# Altium project DC309A.PrjPcb (part 1 of 7)
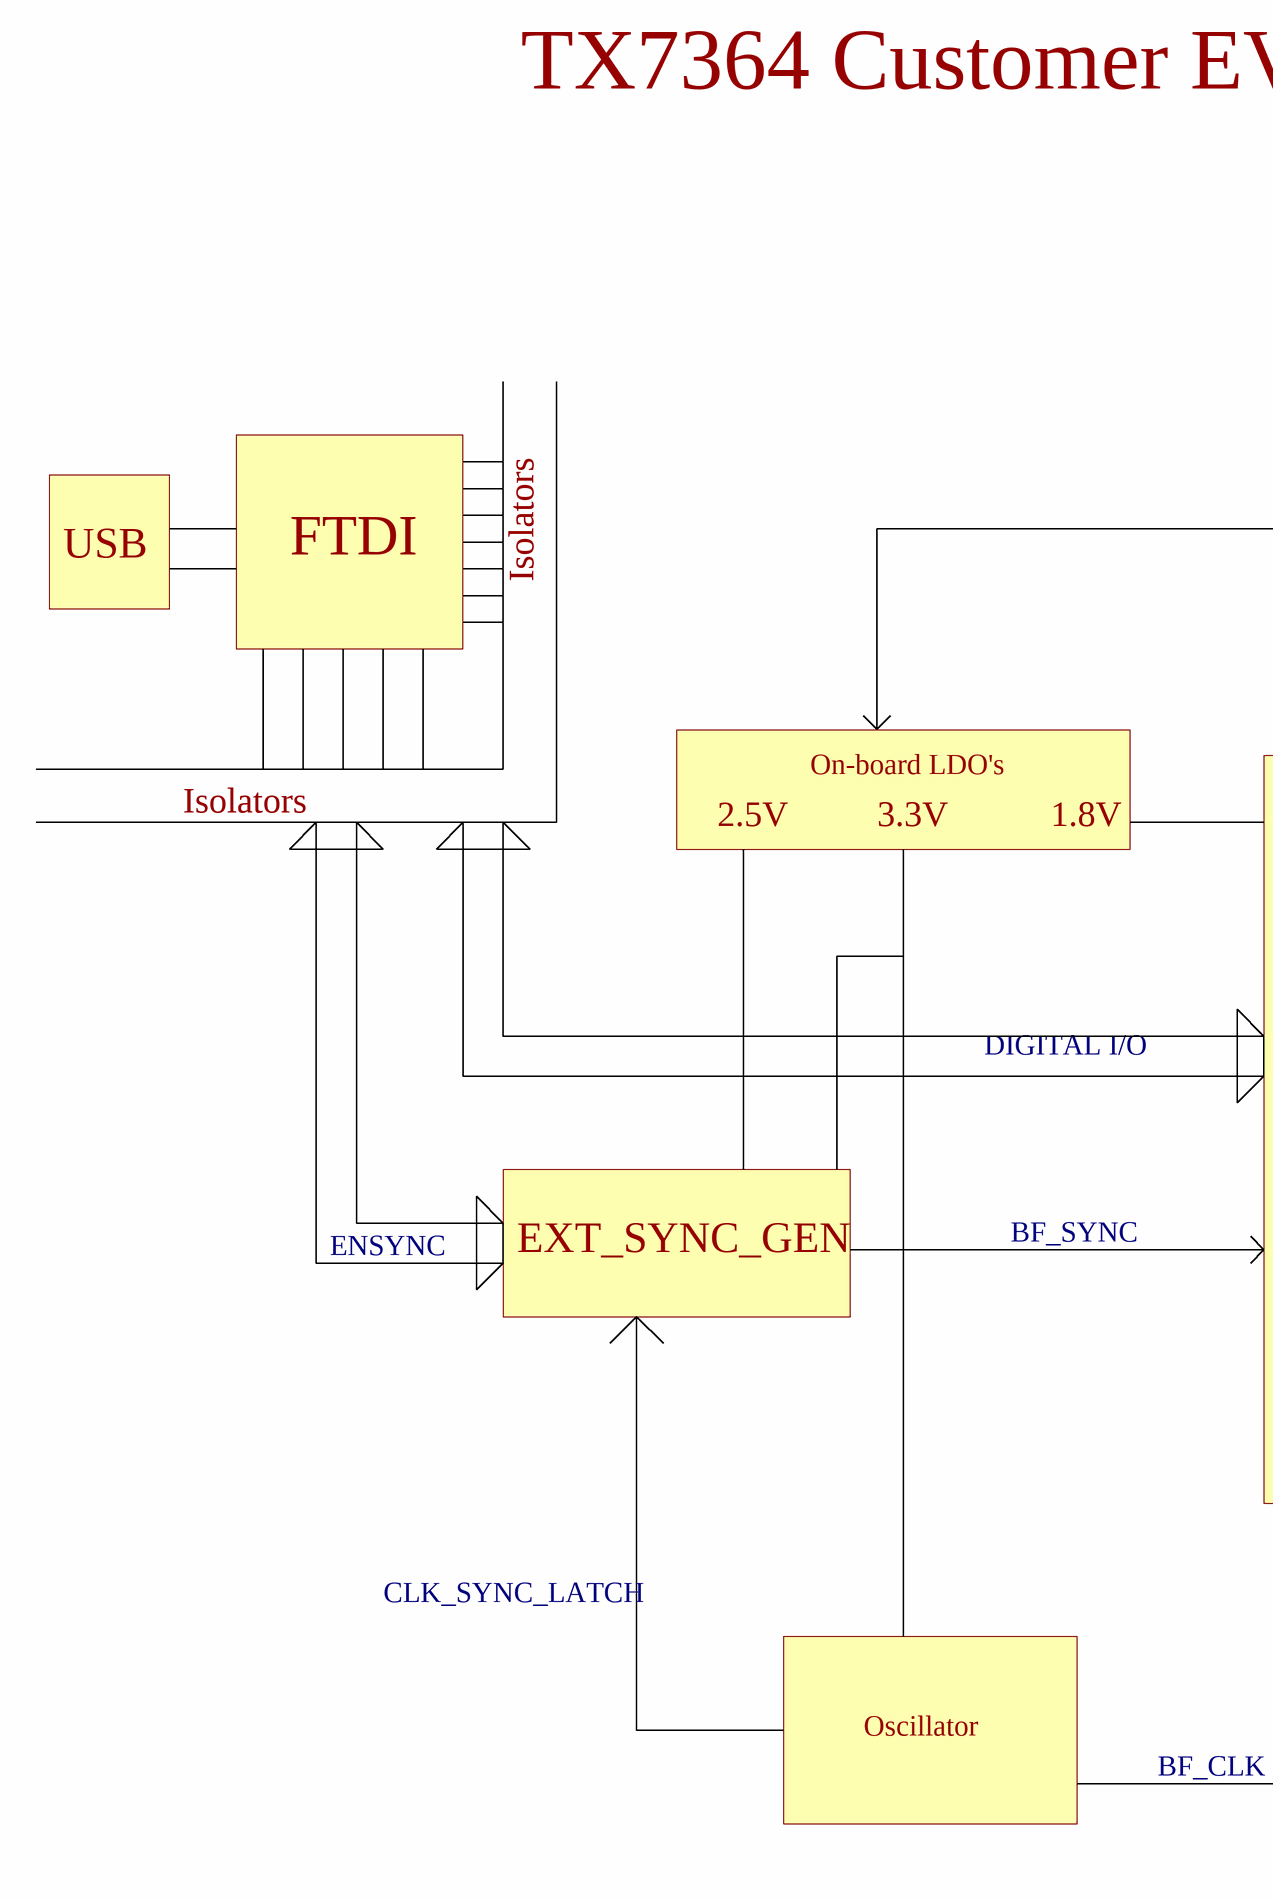
[diagram p0: DC309A_CoverPage_Compact.SchDoc, left]
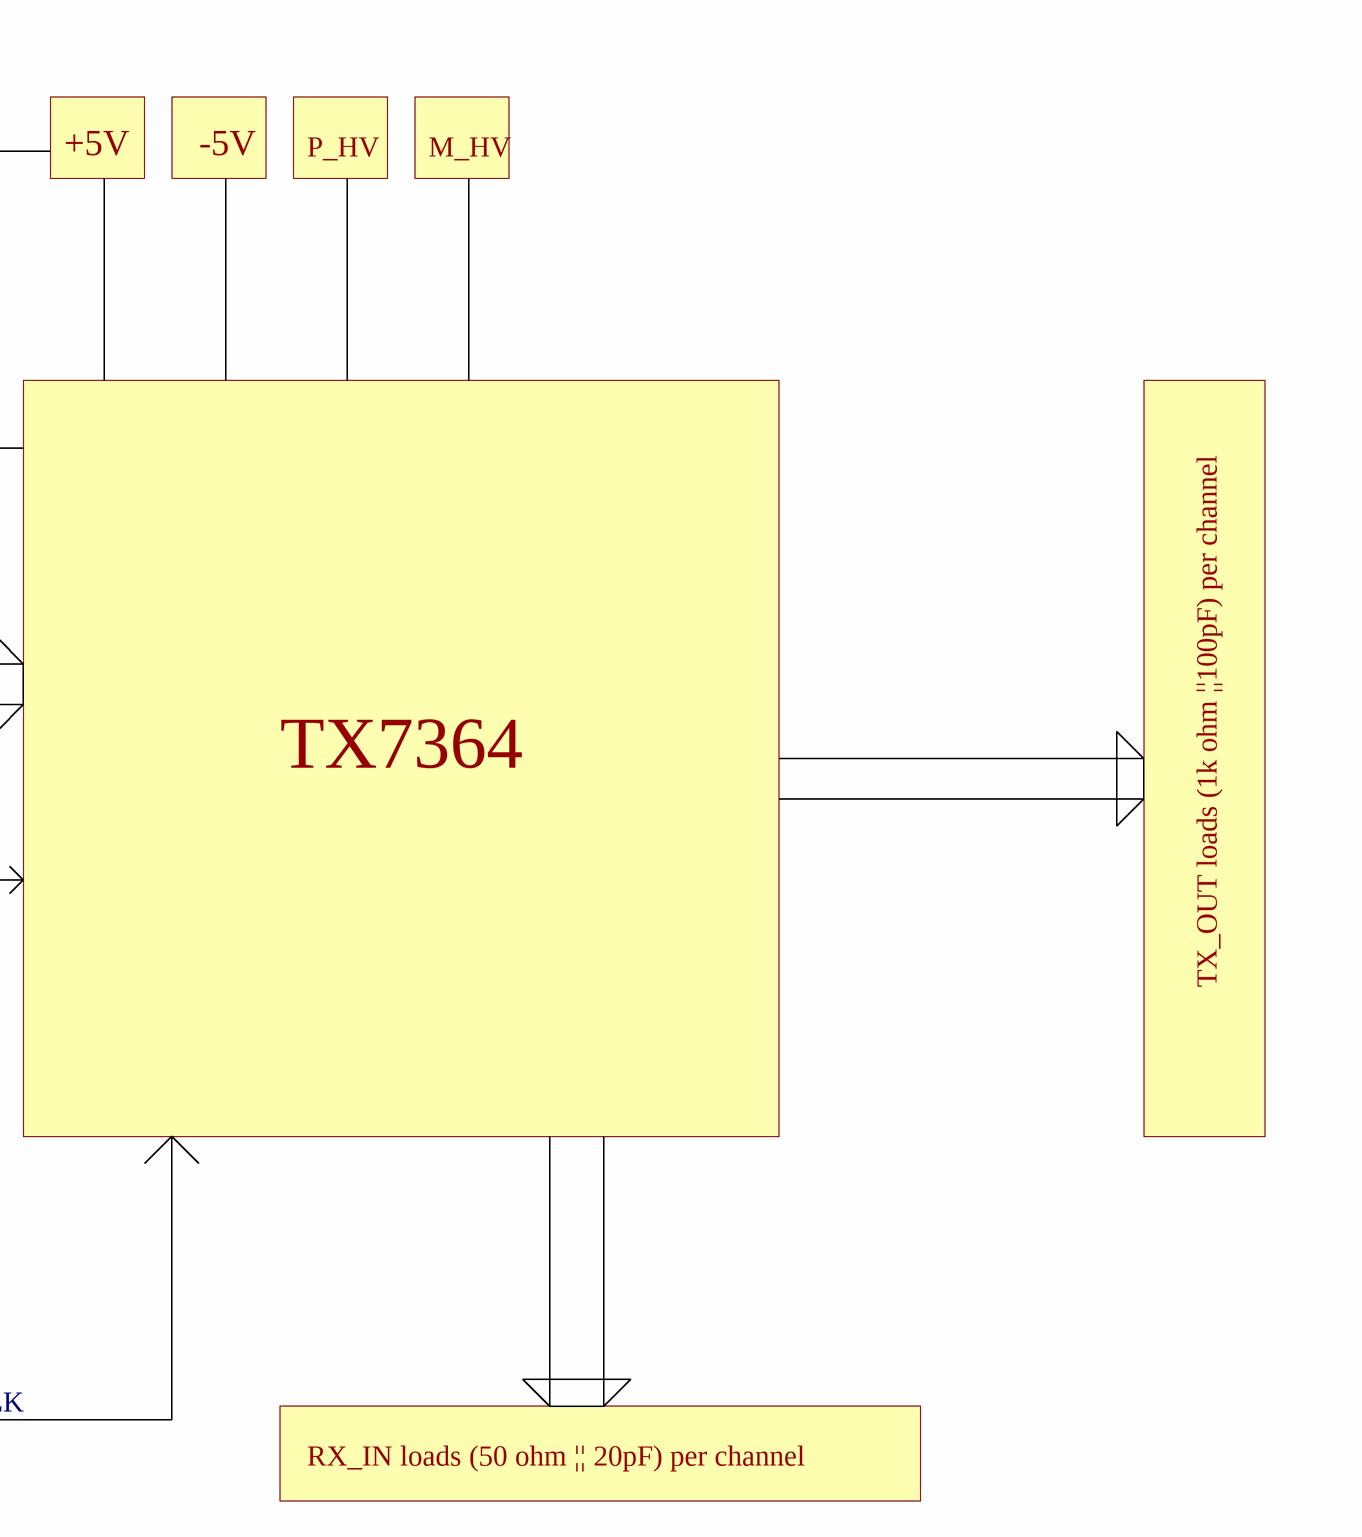
[diagram p1: DC309A_CoverPage_Compact.SchDoc, right]
CopyrightYear: 2018; DrawnBy: KAVIKANNAN; EVM_orderable: TX7364EVM; PCB_Layout: KAVIKANNAN; PCB_REV: A; PRJ_Customer: Public Release; PRJ_Engineer: ROSHAN; PRJ_Number: DC309; PRJ_Title: TX7364 EVM; SCH_Rev: A; TechSupport: http://www.ti.com/support; TID: N/A
11 sheets, 798 parts. Net scope: global (net labels, ports and power ports of the same name join across sheets).
Board file: DC309A.PcbDoc
Sheets:
  DC309A_CoverPage_Compact.SchDoc
  DC309A_Pinout.SchDoc
  DC309A_RXIN.SchDoc
  DC309A_TXOUT.SchDoc
  DC309A_PowerSupplies.SchDoc
  DC309A_FTDI.SchDoc
  DC309A_CLKGen.SchDoc
  DC309A_External_Sync.SchDoc
  DC309A_CPLD.SchDoc
  DC309A_FTDI(DNI).SchDoc
  DC309A_EVM_Hardware.SchDoc

## Sheet DC309A_CoverPage_Compact.SchDoc: CoverPage
size 558 x 431 mm; DrawnBy: KAVIKANNAN; DocumentNumber: 1; SheetNumber: 1; SheetTotal: 11; PageSetup: Record=PageOptions|CenterHorizontal=True|CenterVertical=True|PrintScale=1.00|XCorrection=1.00|YCorrection=1.00|PrintKind=0|BorderSize=5000000|LeftOffset=0|BottomOffset=0|Orientation=2|PaperLength=1000|PaperWidth=1000|Scale=100|PaperSource=15|PrintQuality=600|MediaType=1|DitherType=10|PaperKind=Letter|PrintScaleMode=1

### Notes on the sheet
- TX7364 Customer EVM : Functional block diagram
- USB
- FTDI
- Isolators
- +5V
- -5V
- P_HV
- M_HV
- On-board LDO's
- 2.5V
- 3.3V
- 1.8V
- DIGITAL I/O
- TX7364
- ENSYNC
- EXT_SYNC_GEN
- BF_SYNC
- TX_OUT loads (1k ohm ||100pF) per channel
- CLK_SYNC_LATCH
- Oscillator
- BF_CLK
- RX_IN loads (50 ohm || 20pF) per channel
- Drawn By:
- SVN Rev:
- Number:
- TID #:
- Orderable:
- Rev:
- Sheet Title:
- File:
- Project Title:
- Designed for:
- Assembly Variant:
- Mod. Date:
- Sheet:
- Size:
- of
- C
- http://www.ti.com
- Texas Instruments and/or its licensors do not warrant the accuracy or completeness of this specification or any information contained therein. Texas Instruments and/or its licensors do not warrant that this design will meet the specifications, will be suitable for your application or fit for any particular purpose, or will operate in an implementation. Texas Instruments and/or its licensors do not warrant that the design is production worthy. You should completely validate and test your design implementation to confirm the system functionality for your application.
- Engineer:
- Contact:
- © Texas Instruments

## Sheet DC309A_Pinout.SchDoc: Pinout
size 558 x 431 mm; DrawnBy: KAVIKANNAN; DocumentNumber: 2; SheetNumber: 2; SheetTotal: 11; PageSetup: Record=PageOptions|CenterHorizontal=True|CenterVertical=True|PrintScale=0.69|XCorrection=1.00|YCorrection=1.00|PrintKind=0|BorderSize=5000000|LeftOffset=0|BottomOffset=0|Orientation=2|PaperLength=1000|PaperWidth=1000|Scale=100|PaperSource=15|PrintQuality=600|MediaType=1|DitherType=10|PaperKind=Letter|PrintScaleMode=1
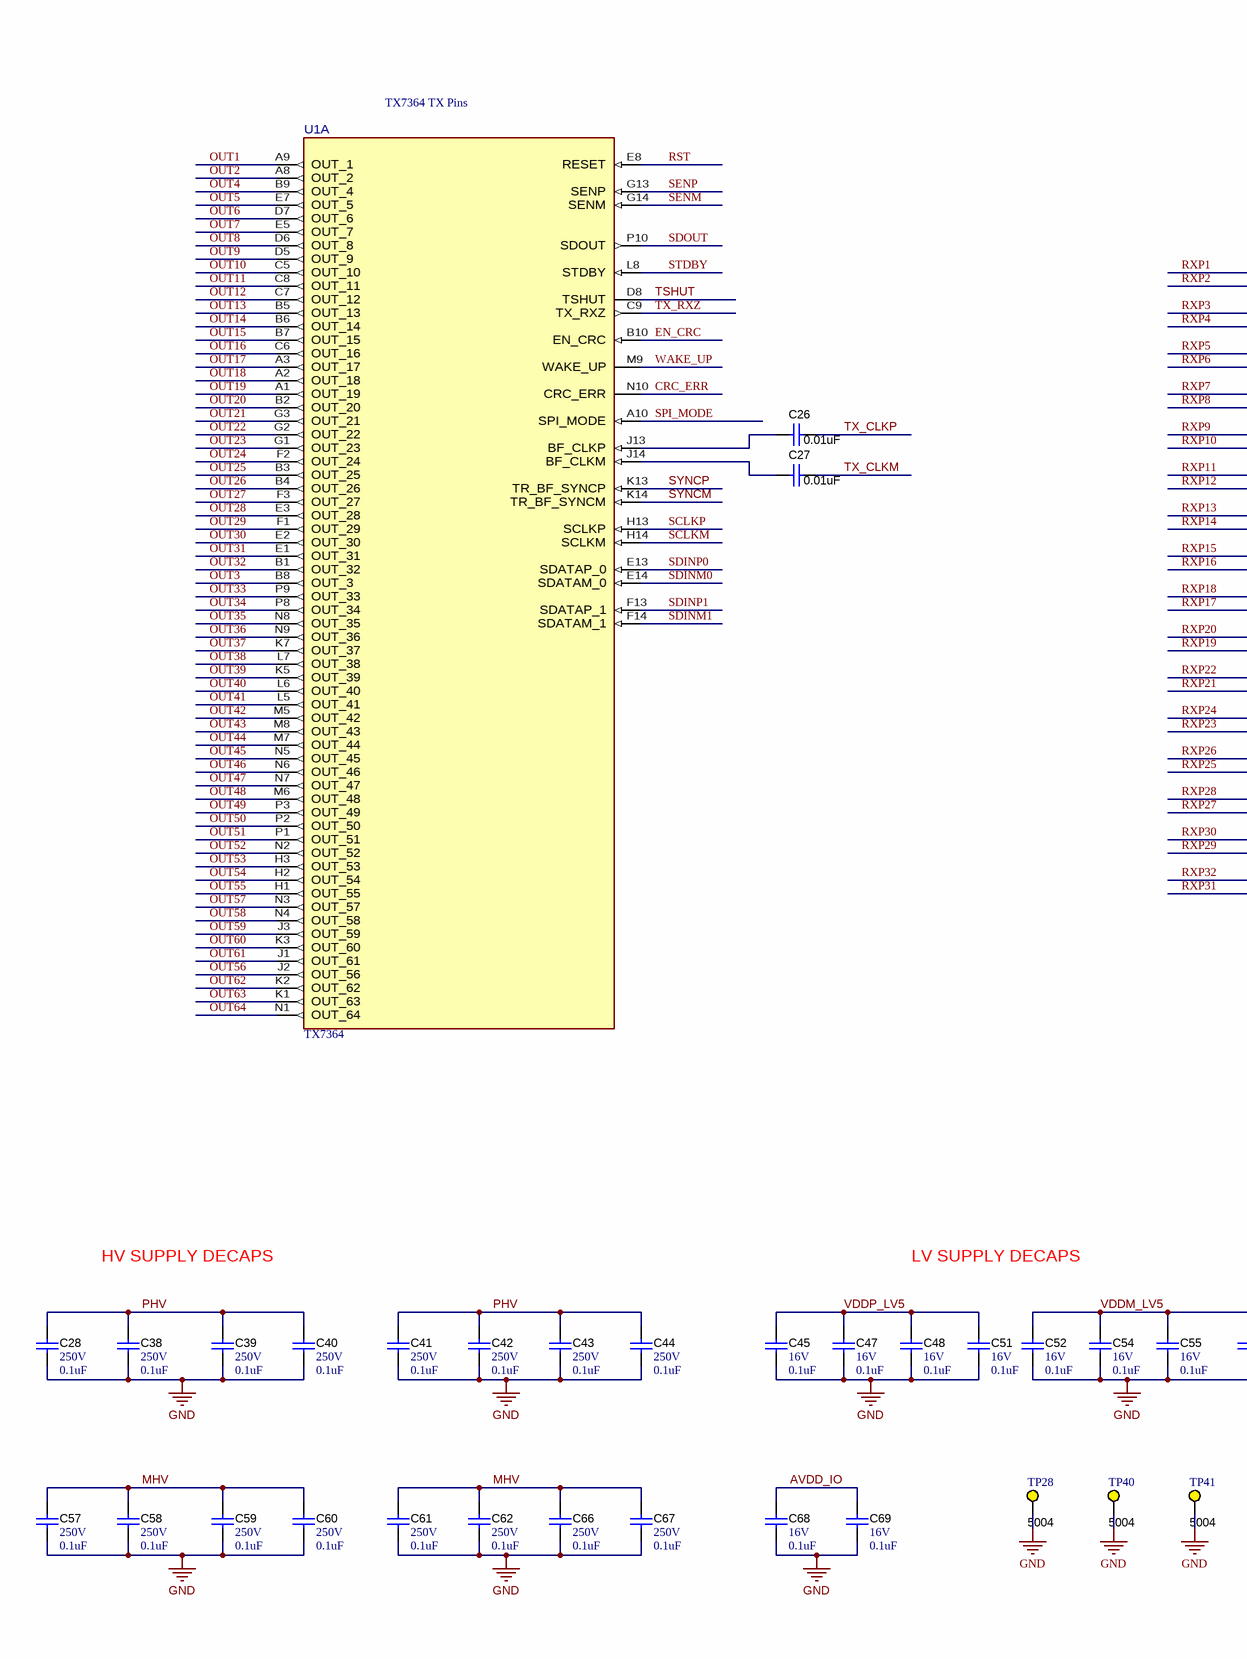
[diagram p2: DC309A_Pinout.SchDoc, left]
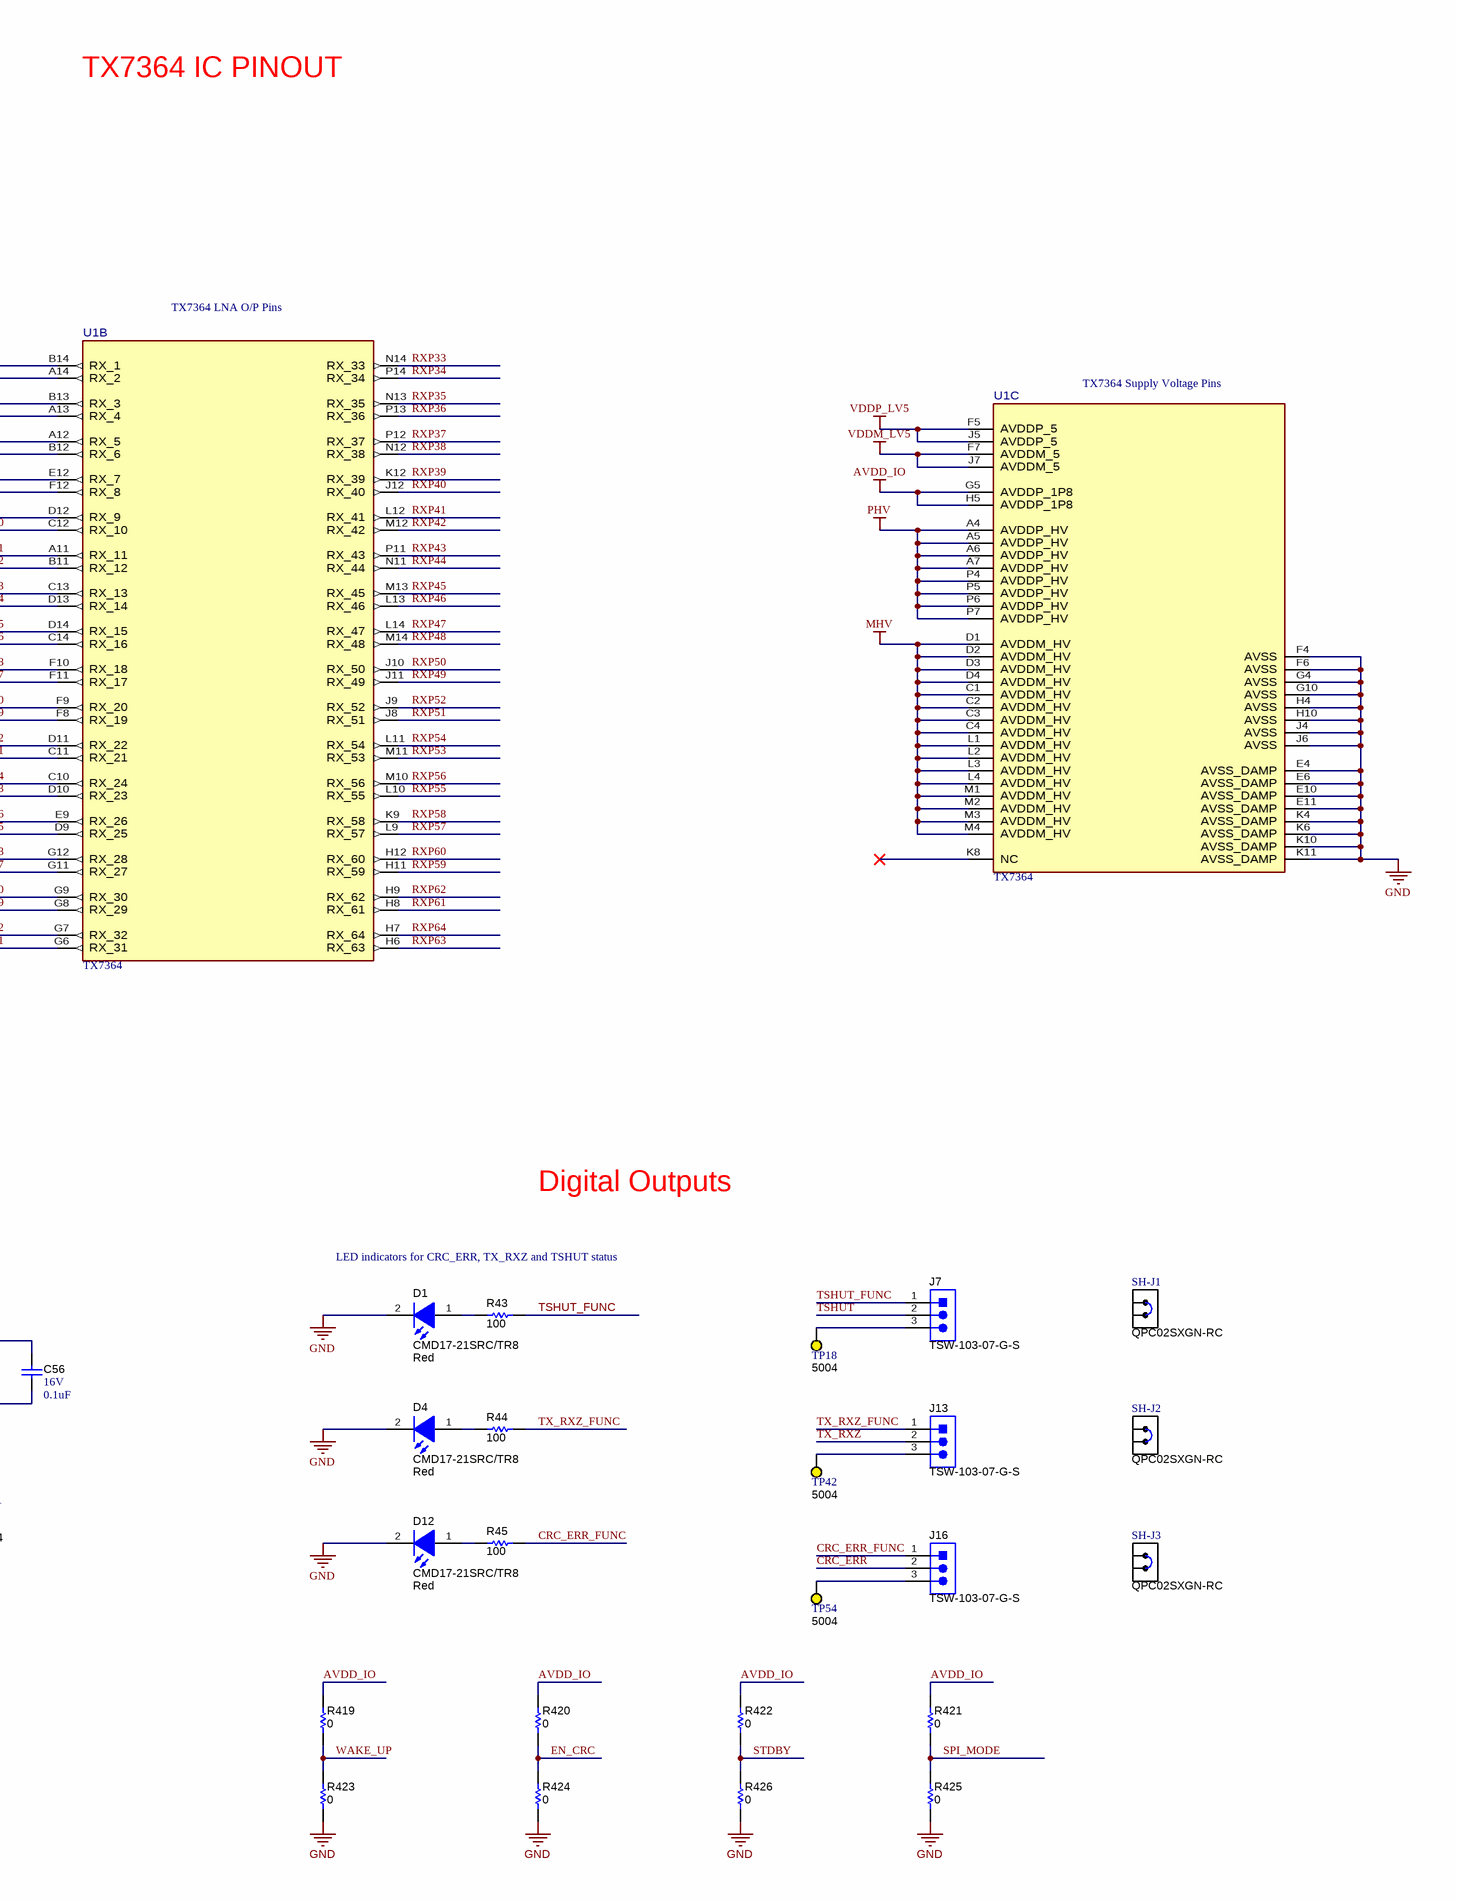
[diagram p3: DC309A_Pinout.SchDoc, right]

### Parts
C26  ValueDisplayed: 0.01uF  [0402_065]  (hidden comment: 520L103KT16T)
C27  ValueDisplayed: 0.01uF  [0402_065]  (hidden comment: 520L103KT16T)
C28  VDC_V: 250V  ValueDisplayed: 0.1uF  [0805_HV]  (hidden comment: C2012X7T2E104K125AA)
C38  VDC_V: 250V  ValueDisplayed: 0.1uF  [0805_HV]  (hidden comment: C2012X7T2E104K125AA)
C39  VDC_V: 250V  ValueDisplayed: 0.1uF  [0805_HV]  (hidden comment: C2012X7T2E104K125AA)
C40  VDC_V: 250V  ValueDisplayed: 0.1uF  [0805_HV]  (hidden comment: C2012X7T2E104K125AA)
C41  VDC_V: 250V  ValueDisplayed: 0.1uF  [0805_HV]  (hidden comment: C2012X7T2E104K125AA)
C42  VDC_V: 250V  ValueDisplayed: 0.1uF  [0805_HV]  (hidden comment: C2012X7T2E104K125AA)
C43  VDC_V: 250V  ValueDisplayed: 0.1uF  [0805_HV]  (hidden comment: C2012X7T2E104K125AA)
C44  VDC_V: 250V  ValueDisplayed: 0.1uF  [0805_HV]  (hidden comment: C2012X7T2E104K125AA)
C45  VDC_V: 16V  ValueDisplayed: 0.1uF  [0201_033]  (hidden comment: C0603X6S1C104K030BC)
C47  VDC_V: 16V  ValueDisplayed: 0.1uF  [0201_033]  (hidden comment: C0603X6S1C104K030BC)
C48  VDC_V: 16V  ValueDisplayed: 0.1uF  [0201_033]  (hidden comment: C0603X6S1C104K030BC)
C51  VDC_V: 16V  ValueDisplayed: 0.1uF  [0201_033]  (hidden comment: C0603X6S1C104K030BC)
C52  VDC_V: 16V  ValueDisplayed: 0.1uF  [0201_033]  (hidden comment: C0603X6S1C104K030BC)
C54  VDC_V: 16V  ValueDisplayed: 0.1uF  [0201_033]  (hidden comment: C0603X6S1C104K030BC)
C55  VDC_V: 16V  ValueDisplayed: 0.1uF  [0201_033]  (hidden comment: C0603X6S1C104K030BC)
C56  VDC_V: 16V  ValueDisplayed: 0.1uF  [0201_033]  (hidden comment: C0603X6S1C104K030BC)
C57  VDC_V: 250V  ValueDisplayed: 0.1uF  [0805_HV]  (hidden comment: C2012X7T2E104K125AA)
C58  VDC_V: 250V  ValueDisplayed: 0.1uF  [0805_HV]  (hidden comment: C2012X7T2E104K125AA)
C59  VDC_V: 250V  ValueDisplayed: 0.1uF  [0805_HV]  (hidden comment: C2012X7T2E104K125AA)
C60  VDC_V: 250V  ValueDisplayed: 0.1uF  [0805_HV]  (hidden comment: C2012X7T2E104K125AA)
C61  VDC_V: 250V  ValueDisplayed: 0.1uF  [0805_HV]  (hidden comment: C2012X7T2E104K125AA)
C62  VDC_V: 250V  ValueDisplayed: 0.1uF  [0805_HV]  (hidden comment: C2012X7T2E104K125AA)
C66  VDC_V: 250V  ValueDisplayed: 0.1uF  [0805_HV]  (hidden comment: C2012X7T2E104K125AA)
C67  VDC_V: 250V  ValueDisplayed: 0.1uF  [0805_HV]  (hidden comment: C2012X7T2E104K125AA)
C68  VDC_V: 16V  ValueDisplayed: 0.1uF  [0201_033]  (hidden comment: C0603X6S1C104K030BC)
C69  VDC_V: 16V  ValueDisplayed: 0.1uF  [0201_033]  (hidden comment: C0603X6S1C104K030BC)
D1  CMD17-21SRC/TR8  value Red  [CMD17-21_Red]
D4  CMD17-21SRC/TR8  value Red  [CMD17-21_Red]
D12  CMD17-21SRC/TR8  value Red  [CMD17-21_Red]
J7  TSW-103-07-G-S  [TSW-103-07-G-S]
J13  TSW-103-07-G-S  [TSW-103-07-G-S]
J16  TSW-103-07-G-S  [TSW-103-07-G-S]
R43  ValueDisplayed: 100  [0402]  (hidden comment: Resistor)
R44  ValueDisplayed: 100  [0402]  (hidden comment: Resistor)
R45  ValueDisplayed: 100  [0402]  (hidden comment: Resistor)
R419  Res_ohm: 0  [0402]  (hidden comment: Resistor)
R420  Res_ohm: 0  [0402]  (hidden comment: Resistor)
R421  Res_ohm: 0  [0402]  (hidden comment: Resistor)
R422  Res_ohm: 0  [0402]  (hidden comment: Resistor)
R423  Res_ohm: 0  [0402]  (hidden comment: Resistor)
R424  Res_ohm: 0  [0402]  (hidden comment: Resistor)
R425  Res_ohm: 0  [0402]  (hidden comment: Resistor)
R426  Res_ohm: 0  [0402]  (hidden comment: Resistor)
SH-J1  QPC02SXGN-RC  [FP-QPC02SXGN-RC_JUMPER-MFG]
SH-J2  QPC02SXGN-RC  [FP-QPC02SXGN-RC_JUMPER-MFG]
SH-J3  QPC02SXGN-RC  [FP-QPC02SXGN-RC_JUMPER-MFG]
TP18  5004  [Keystone5004]
TP28  5004  [Keystone5004]
TP40  5004  [Keystone5004]
TP41  5004  [Keystone5004]
TP42  5004  [Keystone5004]
TP54  5004  [Keystone5004]
U1  TX7364  [ACP0196A-MFG]  (parts A,B,C of 3)

### Nets
AVDD_IO: C68.1 C69.1 R419.2 R420.2 R421.2 R422.2 U1.G5(AVDDP_1P8) U1.H5(AVDDP_1P8)
GND: C28.2 C38.2 C39.2 C40.2 C41.2 C42.2 C43.2 C44.2 C45.2 C47.2 C48.2 C51.2 C52.2 C54.2 C55.2 C56.2 C57.2 C58.2 C59.2 C60.2 C61.2 C62.2 C66.2 C67.2 C68.2 C69.2 D1.2(K) D4.2(K) D12.2(K) R423.1 R424.1 R425.1 R426.1 TP28.1 TP40.1 TP41.1 U1.E4(AVSS_DAMP) U1.E6(AVSS_DAMP) U1.E10(AVSS_DAMP) U1.E11(AVSS_DAMP) U1.F4(AVSS) U1.F6(AVSS) U1.G4(AVSS) U1.G10(AVSS) U1.H4(AVSS) U1.H10(AVSS) U1.J4(AVSS) U1.J6(AVSS) U1.K4(AVSS_DAMP) U1.K6(AVSS_DAMP) U1.K10(AVSS_DAMP) U1.K11(AVSS_DAMP)
MHV: C57.1 C58.1 C59.1 C60.1 C61.1 C62.1 C66.1 C67.1 U1.C1(AVDDM_HV) U1.C2(AVDDM_HV) U1.C3(AVDDM_HV) U1.C4(AVDDM_HV) U1.D1(AVDDM_HV) U1.D2(AVDDM_HV) U1.D3(AVDDM_HV) U1.D4(AVDDM_HV) U1.L1(AVDDM_HV) U1.L2(AVDDM_HV) U1.L3(AVDDM_HV) U1.L4(AVDDM_HV) U1.M1(AVDDM_HV) U1.M2(AVDDM_HV) U1.M3(AVDDM_HV) U1.M4(AVDDM_HV)
PHV: C28.1 C38.1 C39.1 C40.1 C41.1 C42.1 C43.1 C44.1 U1.A4(AVDDP_HV) U1.A5(AVDDP_HV) U1.A6(AVDDP_HV) U1.A7(AVDDP_HV) U1.P4(AVDDP_HV) U1.P5(AVDDP_HV) U1.P6(AVDDP_HV) U1.P7(AVDDP_HV)
VDDM_LV5: C52.1 C54.1 C55.1 C56.1 U1.F7(AVDDM_5) U1.J7(AVDDM_5)
VDDP_LV5: C45.1 C47.1 C48.1 C51.1 U1.F5(AVDDP_5) U1.J5(AVDDP_5)
CRC_ERR: J16.2 U1.N10(CRC_ERR)
CRC_ERR_FUNC: J16.1 R45.1
EN_CRC: R420.1 R424.2 U1.B10(EN_CRC)
OUT1: U1.A9(OUT_1)
OUT2: U1.A8(OUT_2)
OUT3: U1.B8(OUT_3)
OUT4: U1.B9(OUT_4)
OUT5: U1.E7(OUT_5)
OUT6: U1.D7(OUT_6)
OUT7: U1.E5(OUT_7)
OUT8: U1.D6(OUT_8)
OUT9: U1.D5(OUT_9)
OUT10: U1.C5(OUT_10)
OUT11: U1.C8(OUT_11)
OUT12: U1.C7(OUT_12)
OUT13: U1.B5(OUT_13)
OUT14: U1.B6(OUT_14)
OUT15: U1.B7(OUT_15)
OUT16: U1.C6(OUT_16)
OUT17: U1.A3(OUT_17)
OUT18: U1.A2(OUT_18)
OUT19: U1.A1(OUT_19)
OUT20: U1.B2(OUT_20)
OUT21: U1.G3(OUT_21)
OUT22: U1.G2(OUT_22)
OUT23: U1.G1(OUT_23)
OUT24: U1.F2(OUT_24)
OUT25: U1.B3(OUT_25)
OUT26: U1.B4(OUT_26)
OUT27: U1.F3(OUT_27)
OUT28: U1.E3(OUT_28)
OUT29: U1.F1(OUT_29)
OUT30: U1.E2(OUT_30)
OUT31: U1.E1(OUT_31)
OUT32: U1.B1(OUT_32)
OUT33: U1.P9(OUT_33)
OUT34: U1.P8(OUT_34)
OUT35: U1.N8(OUT_35)
OUT36: U1.N9(OUT_36)
OUT37: U1.K7(OUT_37)
OUT38: U1.L7(OUT_38)
OUT39: U1.K5(OUT_39)
OUT40: U1.L6(OUT_40)
OUT41: U1.L5(OUT_41)
OUT42: U1.M5(OUT_42)
OUT43: U1.M8(OUT_43)
OUT44: U1.M7(OUT_44)
OUT45: U1.N5(OUT_45)
OUT46: U1.N6(OUT_46)
OUT47: U1.N7(OUT_47)
OUT48: U1.M6(OUT_48)
OUT49: U1.P3(OUT_49)
OUT50: U1.P2(OUT_50)
OUT51: U1.P1(OUT_51)
OUT52: U1.N2(OUT_52)
OUT53: U1.H3(OUT_53)
OUT54: U1.H2(OUT_54)
OUT55: U1.H1(OUT_55)
OUT56: U1.J2(OUT_56)
OUT57: U1.N3(OUT_57)
OUT58: U1.N4(OUT_58)
OUT59: U1.J3(OUT_59)
OUT60: U1.K3(OUT_60)
OUT61: U1.J1(OUT_61)
OUT62: U1.K2(OUT_62)
OUT63: U1.K1(OUT_63)
OUT64: U1.N1(OUT_64)
RST: U1.E8(RESET)
RXP1: U1.B14(RX_1)
RXP2: U1.A14(RX_2)
RXP3: U1.B13(RX_3)
RXP4: U1.A13(RX_4)
RXP5: U1.A12(RX_5)
RXP6: U1.B12(RX_6)
RXP7: U1.E12(RX_7)
RXP8: U1.F12(RX_8)
RXP9: U1.D12(RX_9)
RXP10: U1.C12(RX_10)
RXP11: U1.A11(RX_11)
RXP12: U1.B11(RX_12)
RXP13: U1.C13(RX_13)
RXP14: U1.D13(RX_14)
RXP15: U1.D14(RX_15)
RXP16: U1.C14(RX_16)
RXP17: U1.F11(RX_17)
RXP18: U1.F10(RX_18)
RXP19: U1.F8(RX_19)
RXP20: U1.F9(RX_20)
RXP21: U1.C11(RX_21)
RXP22: U1.D11(RX_22)
RXP23: U1.D10(RX_23)
RXP24: U1.C10(RX_24)
RXP25: U1.D9(RX_25)
RXP26: U1.E9(RX_26)
RXP27: U1.G11(RX_27)
RXP28: U1.G12(RX_28)
RXP29: U1.G8(RX_29)
RXP30: U1.G9(RX_30)
RXP31: U1.G6(RX_31)
RXP32: U1.G7(RX_32)
RXP33: U1.N14(RX_33)
RXP34: U1.P14(RX_34)
RXP35: U1.N13(RX_35)
RXP36: U1.P13(RX_36)
RXP37: U1.P12(RX_37)
RXP38: U1.N12(RX_38)
RXP39: U1.K12(RX_39)
RXP40: U1.J12(RX_40)
RXP41: U1.L12(RX_41)
RXP42: U1.M12(RX_42)
RXP43: U1.P11(RX_43)
RXP44: U1.N11(RX_44)
RXP45: U1.M13(RX_45)
RXP46: U1.L13(RX_46)
RXP47: U1.L14(RX_47)
RXP48: U1.M14(RX_48)
RXP49: U1.J11(RX_49)
RXP50: U1.J10(RX_50)
RXP51: U1.J8(RX_51)
RXP52: U1.J9(RX_52)
RXP53: U1.M11(RX_53)
RXP54: U1.L11(RX_54)
RXP55: U1.L10(RX_55)
RXP56: U1.M10(RX_56)
RXP57: U1.L9(RX_57)
RXP58: U1.K9(RX_58)
RXP59: U1.H11(RX_59)
RXP60: U1.H12(RX_60)
RXP61: U1.H8(RX_61)
RXP62: U1.H9(RX_62)
RXP63: U1.H6(RX_63)
RXP64: U1.H7(RX_64)
SCLKM: U1.H14(SCLKM)
SCLKP: U1.H13(SCLKP)
SDINM0: U1.E14(SDATAM_0)
SDINM1: U1.F14(SDATAM_1)
SDINP0: U1.E13(SDATAP_0)
SDINP1: U1.F13(SDATAP_1)
SDOUT: U1.P10(SDOUT)
SENM: U1.G14(SENM)
SENP: U1.G13(SENP)
SPI_MODE: R421.1 R425.2 U1.A10(SPI_MODE)
STDBY: R422.1 R426.2 U1.L8(STDBY)
SYNCM: U1.K14(TR_BF_SYNCM)
SYNCP: U1.K13(TR_BF_SYNCP)
TSHUT: J7.2 U1.D8(TSHUT)
TSHUT_FUNC: J7.1 R43.1
TX_CLKM: C27.2
TX_CLKP: C26.2
TX_RXZ: J13.2 U1.C9(TX_RXZ)
TX_RXZ_FUNC: J13.1 R44.1
WAKE_UP: R419.1 R423.2 U1.M9(WAKE_UP)
NetC26_1: C26.1 U1.J13(BF_CLKP)
NetC27_1: C27.1 U1.J14(BF_CLKM)
NetD1_1: D1.1(A) R43.2
NetD4_1: D4.1(A) R44.2
NetD12_1: D12.1(A) R45.2
NetJ7_3: J7.3 TP18.1
NetJ13_3: J13.3 TP42.1
NetJ16_3: J16.3 TP54.1

Not connected (* = marked no-connect by the designer): U1 K8(NC)*

### Notes on the sheet
- TX7364 IC PINOUT
- TX7364 TX Pins
- TX7364 LNA O/P Pins
- (near U1) TX7364 Supply Voltage Pins
- LED indicators for CRC_ERR, TX_RXZ and TSHUT status
- Digital Outputs
- HV SUPPLY DECAPS
- LV SUPPLY DECAPS
- Drawn By:
- SVN Rev:
- Number:
- TID #:
- Orderable:
- Rev:
- Sheet Title:
- File:
- Project Title:
- Designed for:
- Assembly Variant:
- Mod. Date:
- Sheet:
- Size:
- of
- C
- http://www.ti.com
- Texas Instruments and/or its licensors do not warrant the accuracy or completeness of this specification or any information contained therein. Texas Instruments and/or its licensors do not warrant that this design will meet the specifications, will be suitable for your application or fit for any particular purpose, or will operate in an implementation. Texas Instruments and/or its licensors do not warrant that the design is production worthy. You should completely validate and test your design implementation to confirm the system functionality for your application.
- Engineer:
- Contact:
- © Texas Instruments

### Library data of the parts
C26 C27 = CMP-0006210-2: CAP, CERM, 0.01 uF, 16 V, +/- 10%, X7R, 0402; Manufacturer: AT Ceramics; TaMin_C: -55°C; Polarized: N; SizeAreaWB_mm2: 3; Value1: Unknown; U/M: EA; Value: 0.01uF; TaMax_C: 125°C; SizeZ_mm: 0.65; SizeX_mm: 1; SizeY_mm: 0.5; Cap_Case: 0402; Value2: 16V; CompType: Capacitor; Cap_F: 10nF; AEC Category: Q200; Supplier Part Number 2: 581-520L103KT16T; Publisher: Texas Instruments; Supplier 2: Mouser; TempCo: X7R; Published: 2008-06-19; RoHS: Y; MountType: SMT; Supplier 1: Digi-Key; PackageReference: 0402; Tolerance_%: 10%; SizeArea_mm2: 0.5; LatestRevisionDate: 2017-03-09; PartNumber: 520L103KT16T; AEC Qualified: N; VDC_V: 16V; ComponentLink1Description: Datasheet link; AEC Grade: N/A; Supplier Part Number 1: 1284-1540-1-ND; Technology: Ceramic; ComponentLink1URL: https://www.atceramics.com/UserFiles/520l.pdf
C28 C38-C44 C57-C62 C66 C67 = CMP-0007897-1: CAP, CERM, 0.1 uF, 250 V, +/- 10%, X7T, 0805; Manufacturer: TDK; TaMin_C: -55°C; Polarized: N; SizeAreaWB_mm2: 6.75; Value1: Unknown; U/M: EA; Value: 0.1uF; TaMax_C: 125°C; SizeZ_mm: 1.45; SizeX_mm: 2; SizeY_mm: 1.25; Cap_Case: 0805; SizeArea_mm2: 2.5; Cap_F: 100nF; AEC Category: Q200; ComponentLink1URL: http://product.tdk.com/en/catalog/spec/mlccspec_commercial_general_midvoltage_en.pdf; Supplier Part Number 2: 51T2714; Publisher: Texas Instruments; Supplier 2: Newark; Supplier Part Number 3: 810-C2012X7T2E104KAA; TempCo: X7T; Supplier 3: Mouser; Published: 2008-06-19; RoHS: Y; MountType: SMT; Supplier 1: Digi-Key; PackageReference: 0805; Tolerance_%: 10%; Value2: 250V; CompType: Capacitor; LatestRevisionDate: 2017-03-09; PartNumber: C2012X7T2E104K125AA; AEC Qualified: N; ComponentLink1Description: Datasheet link; AEC Grade: N/A; Supplier Part Number 1: 445-7749-1-ND; Technology: Ceramic
C45 C47 C48 C51 C52 C54-C56 C68 C69 = CMP-0009637-3: CAP, CERM, 0.1 uF, 16 V, +/- 10%, X6S, 0201; Manufacturer: TDK; TaMin_C: -55°C; Polarized: N; SizeAreaWB_mm2: 2.08; Value1: Unknown; U/M: EA; Value: 0.1uF; TaMax_C: 105°C; SizeZ_mm: 0.33; SizeX_mm: 0.6; SizeY_mm: 0.3; Cap_Case: 0201; SizeArea_mm2: 0.18; Cap_F: 100nF; AEC Category: Q200; ComponentLink1URL: http://product.tdk.com/en/catalog/datasheets/mlcc_commercial_general_en.pdf; Supplier Part Number 2: 17X8592; Publisher: Texas Instruments; Supplier 2: Newark; Supplier Part Number 3: 810-C0603X6S1C104KBC; TempCo: X6S; Supplier 3: Mouser; Published: 2008-06-19; RoHS: Y; MountType: SMT; Supplier 1: Digi-Key; PackageReference: 0201; Tolerance_%: 10%; Value2: 16V; CompType: Capacitor; LatestRevisionDate: 2017-03-09; PartNumber: C0603X6S1C104K030BC; AEC Qualified: N; ComponentLink1Description: Datasheet link; AEC Grade: N/A; Supplier Part Number 1: 445-15903-1-ND; Technology: Ceramic
D1 D4 D12 = CMP-0084855-1: LED, Red, SMD; Manufacturer: Visual Communications Company, LLC; SizeX_mm: 2; SizeArea_mm2: 2.5; SizeAreaWB_mm2: 6.75; Angle: 140; Value2: 1.7V; Ir_A: 100µA; Value1: 0.1W; SizeY_mm: 1.25; Io_A: 20mA; Tjmax_C: 85°C; Power_TotalModule: 100mW; SizeZ_mm: 1.2; Vr_V: 5V; ComponentLink1URL: https://vcclite.com/wp-content/uploads/wpallimport/files/files/CMD1721Seriesver3.pdf; ComponentLink1Description: Datasheet link; PackageReference: 2x1.25mm; Color: Red; PartNumber: CMD17-21SRC/TR8; Vf_V: 1.7V; RoHS: Y; MountType: SMT; Type: ?; CompType: LED
J7 J13 J16 = CMP-0075407-2: Header, 100mil, 3x1, Gold, TH; Manufacturer: Samtec; Pitch_mm: 2.54; Cert_VDE: N; Gender: Male; Cert_CSA: Y; Voltage_V: 550V; Green_REACh: Passed; Current_A: 6.3A; Green_Lifecycle: Active; Row_Count: 1; ComponentLink1Description: Datasheet URL; RoHS: Y; Supplier 1: Digi-Key; Cert_UL: Y; Orientation: Vertical; Green_EU RoHS: Passed; PackageReference: 3x1 Header; Color: Black; PartNumber: TSW-103-07-G-S; PinCount: 3; ContactFinish: Gold; Cert_CULUS: N; Shrouded: N; ClassName: Header; ComponentLink1URL: http://samtec.com/ftppub/pdf/TSW_TH.PDF; CompType: Header; MountType: TH; Supplier Part Number 1: SAM1029-03-ND; Green_EU RoHS-2: Passed
R43-R45 = CMP-0026993-2: RES, 100, 5%, 0.1 W, AEC-Q200 Grade 0, 0402; PartNumber: ERJ-2GEJ101X; Manufacturer: Panasonic; Value: 100; Value_Code: 100R; Power_W: 100mW; Value2: 0.1W; TempCo: 200 ppm/C; SizeArea_mm2: 0.5; SizeX_mm: 1; SizeZ_mm: 0.6; EIA_Code: E24; U/M: EA; AEC Category: Q200; AEC Qualified: Y; AEC Grade: 0; CompType: Resistor; PackageReference: 0402; RoHS: Y; Res_ohm: 100; Tolerance_%: 5%; Value1: 5%; MountType: SMT; Technology: Thick Film; SizeY_mm: 0.5; Published: 2008-06-26; Publisher: Texas Instruments; LatestRevisionDate: 2017-03-09; ComponentLink1Description: Datasheet link; ComponentLink1URL: https://industrial.panasonic.com/cdbs/www-data/pdf/RDA0000/AOA0000C84.pdf; Supplier 1: Digi-Key; Supplier Part Number 1: P100JCT-ND; Supplier 2: Newark; Supplier Part Number 2: 65T8246; Supplier 3: Farnell; Supplier Part Number 3: 2059210
R419-R426 = CMP-0026992-3: RES, 0, 5%, 0.1 W, AEC-Q200 Grade 0, 0402; PartNumber: ERJ-2GE0R00X; Manufacturer: Panasonic; Value_Code: 0000; Power_W: 100mW; Value2: 0.1W; VDC_V: 50V; TempCo: 600 ppm/C; SizeArea_mm2: 0.5; SizeX_mm: 1; SizeZ_mm: 0.6; EIA_Code: E24; AEC Category: Q200; AEC Qualified: Y; SizeAreaWB_mm2: 3; CompType: Resistor; PackageReference: 0402; RoHS: Y; Tolerance_%: 5%; Value1: 5%; MountType: SMT; Technology: Thick Film; SizeY_mm: 0.5; ComponentLink1Description: Datasheet link; ComponentLink1URL: https://industrial.panasonic.com/cdbs/www-data/pdf/RDA0000/AOA0000C301.pdf; Supplier 1: Digi-Key; Supplier Part Number 1: P0.0JCT-ND; Supplier 2: Newark; Supplier Part Number 2: 65T8307; Supplier 3: Mouser; Supplier Part Number 3: 667-ERJ-2GE0R00X; AEC Grade: 0; ValueDisplayed: 0
SH-J1-SH-J3 = CMP-0087961-2: CONN JUMPER S2 (1 x 2) Position Shunt Connector Black Open Top 0.100" (2.54mm) GoldHORTING .100" GOLD; Manufacturer: Sullins; Current_A: 3A; Symbol Name: SYM-QPC02SXGN-RC; RoHS: TRUE; PackageReference: JUMPER; PartNumber: QPC02SXGN-RC; ContactFinish: Gold; ComponentLink1URL: https://s3.amazonaws.com/catalogspreads-pdf/PAGE128-129%20.100%20JUMPER.pdf; ComponentLink1Description: Datasheet; PinCount: 2
TP18 TP28 TP40-TP42 TP54 = CMP-0055141-2: Test Point, Miniature, Yellow, TH; Manufacturer: Keystone Electronics; CT: TRUE; ContactFinish: Silver; Green_Lifecycle: Active; CNHeader: FALSE; Green_REACh: Passed; Supplier 2: Mouser; RoHS: Y; Publisher: Texas Instruments; PackageReference: Yellow Miniature Testpoint; CompType: Test Point; Green_EU RoHS: Passed; Color: Yellow; PartNumber: 5004; Green_EU RoHS-2: Incomplete; LatestRevisionDate: 26/05/2017; Supplier 1: Digi-Key; Supplier Part Number 1: 36-5004-ND; Supplier Part Number 2: 534-5004; MountType: TH; ComponentLink1URL: http://www.keyelco.com/userAssets/file/M60-2p60.pdf; ComponentLink1Description: Datasheet URL
U1 = CMP-0096492-3: Manufacturer: Texas Instruments; CompType: IC; AEC Category: Q200; Standoff Height: 0.293mm; SizeZ_mm: 1.321mm; ComponentLink1Description: Datasheet Link; Part Number: TX7364; PartNumber: TX7364; ComponentLink2URL: http://www.ti.com/product/GPN; Operating Temperature Range: to; ComponentLink3URL: http://www.ti.com/product/GPN/datasheet; Datasheet Path: datasheets/IC-TX7364.pdf; ComponentLink3Description: Online Datasheet; ComponentLink1URL: http://www.ti.com/lit/ds/symlink/GPN.pdf; ComponentLink2Description: Product Folder; helpURL: https://upverter.com/upn/revision/116a209f64e0270f/; PackageReference: FCBGA196; RoHS: UNKNOWN; PartId: 1

## Sheet DC309A_RXIN.SchDoc: RXIN
size 558 x 431 mm; Date: Not shown in title block; ApprovedBy: Not shown in title block; CheckedBy: Not shown in title block; Author: Not shown in title block; CompanyName: Not shown in title block; DrawnBy: KAVIKANNAN; Engineer: Not shown in title block; Organization: Not shown in title block; Address1: Not shown in title block; Address2: Not shown in title block; Address3: Not shown in title block; Address4: Not shown in title block; DocumentNumber: 3; Revision: Use project parameter SCH_Rev; SheetNumber: 3; SheetTotal: 11; PageSetup: Record=PageOptions|CenterHorizontal=True|CenterVertical=True|PrintScale=1.00|XCorrection=1.00|YCorrection=1.00|PrintKind=0|BorderSize=5000000|LeftOffset=0|BottomOffset=0|Orientation=2|PaperLength=1000|PaperWidth=1000|Scale=100|PaperSource=15|PrintQuality=600|MediaType=1|DitherType=10|PaperKind=Letter|PrintScaleMode=1; CurrentTime: Not shown in title block; CurrentDate: Not shown in title block; Time: Not shown in title block; DocumentFullPathAndName: Not shown in title block; DocumentName: Not shown in title block; ModifiedDate: Not shown in title block; ImagePath: Not shown in title block
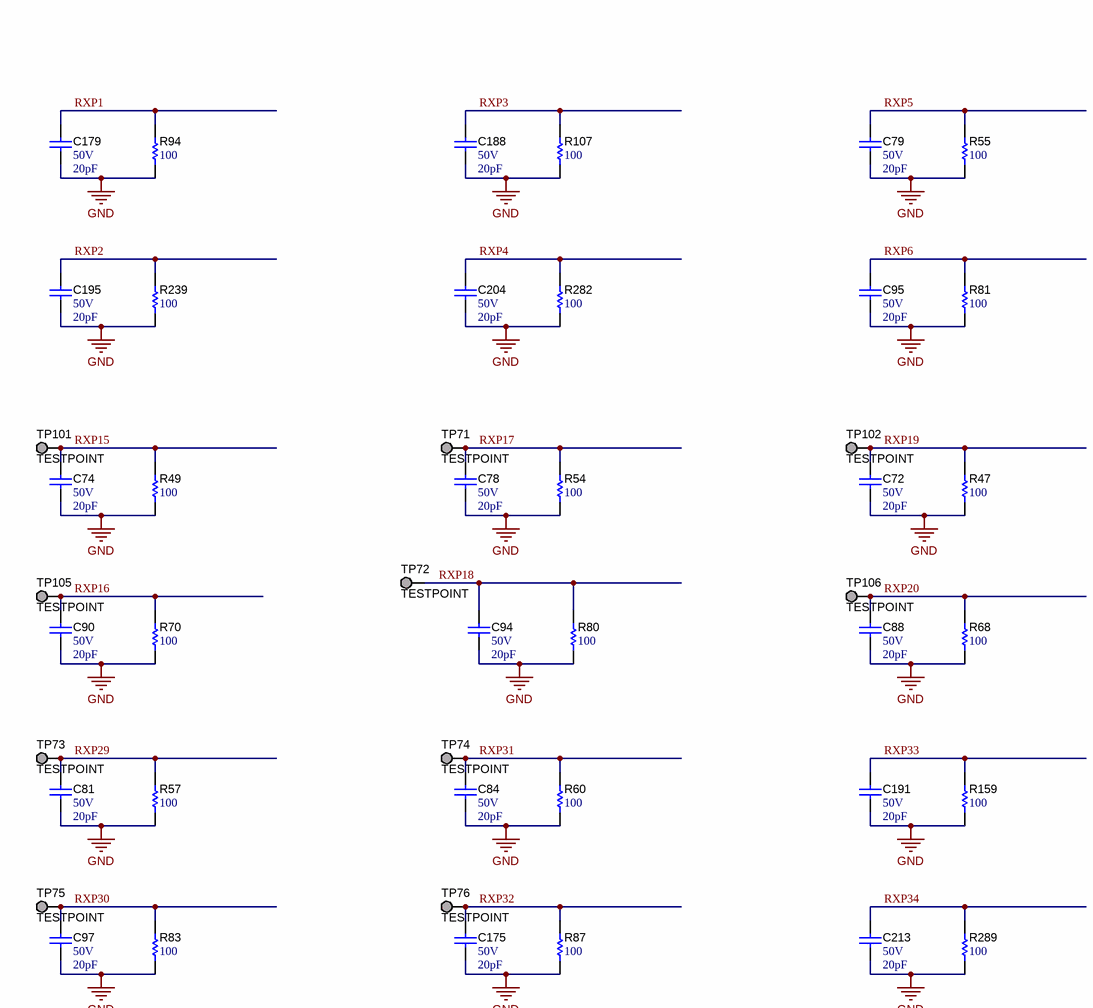
[diagram p4: DC309A_RXIN.SchDoc, top left]
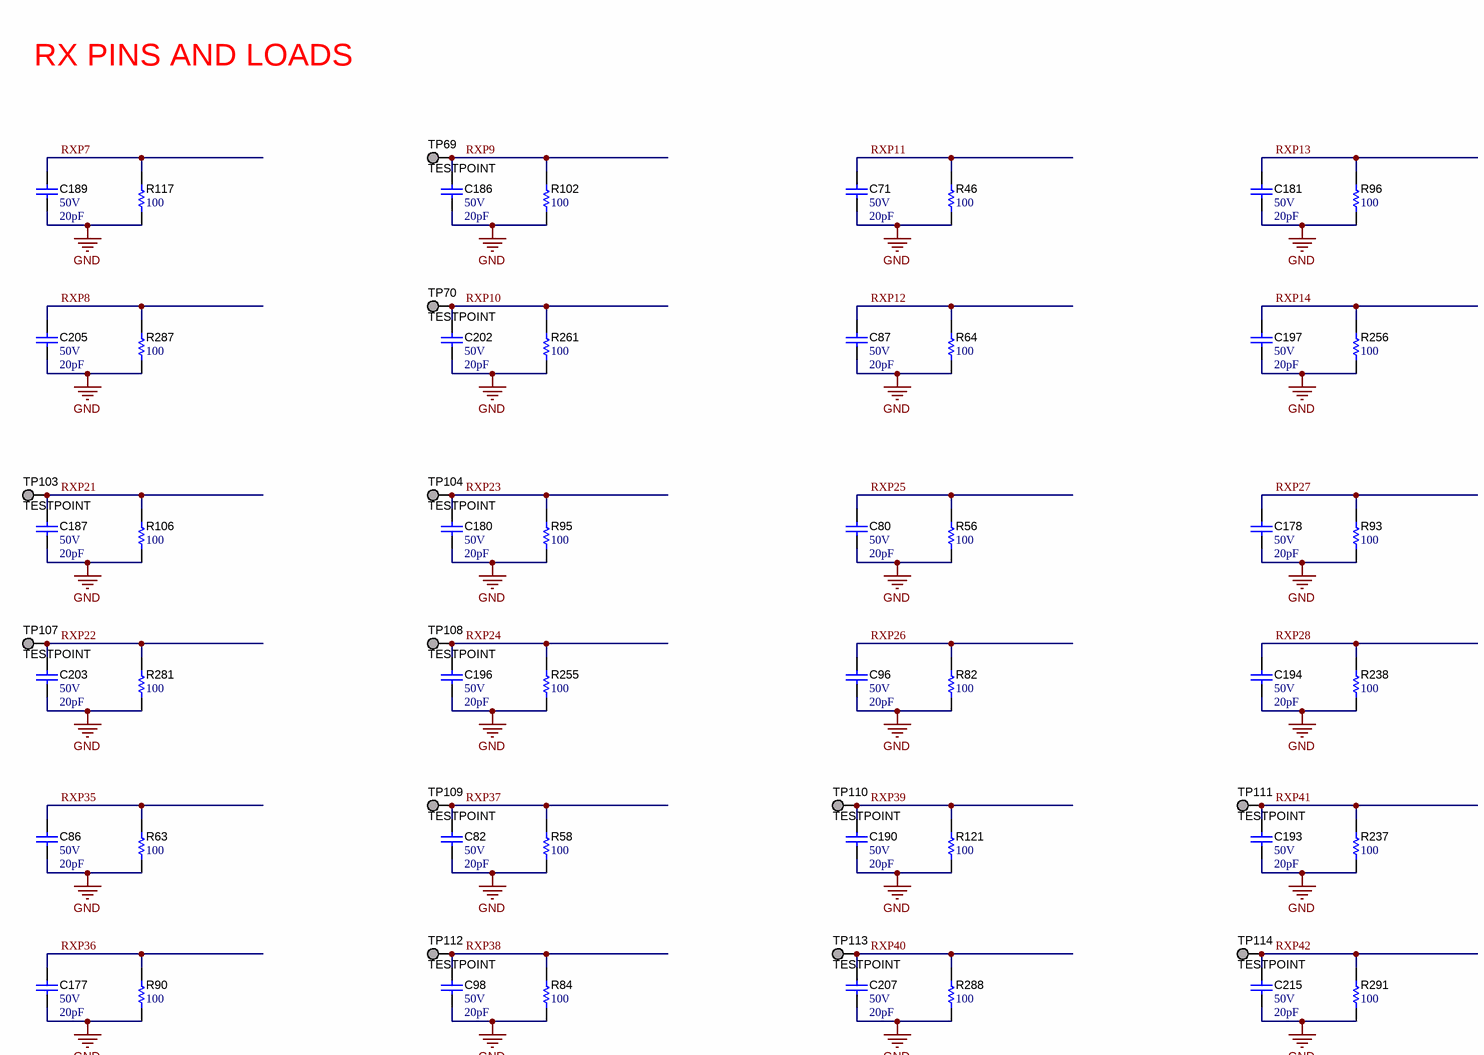
[diagram p5: DC309A_RXIN.SchDoc, top right]
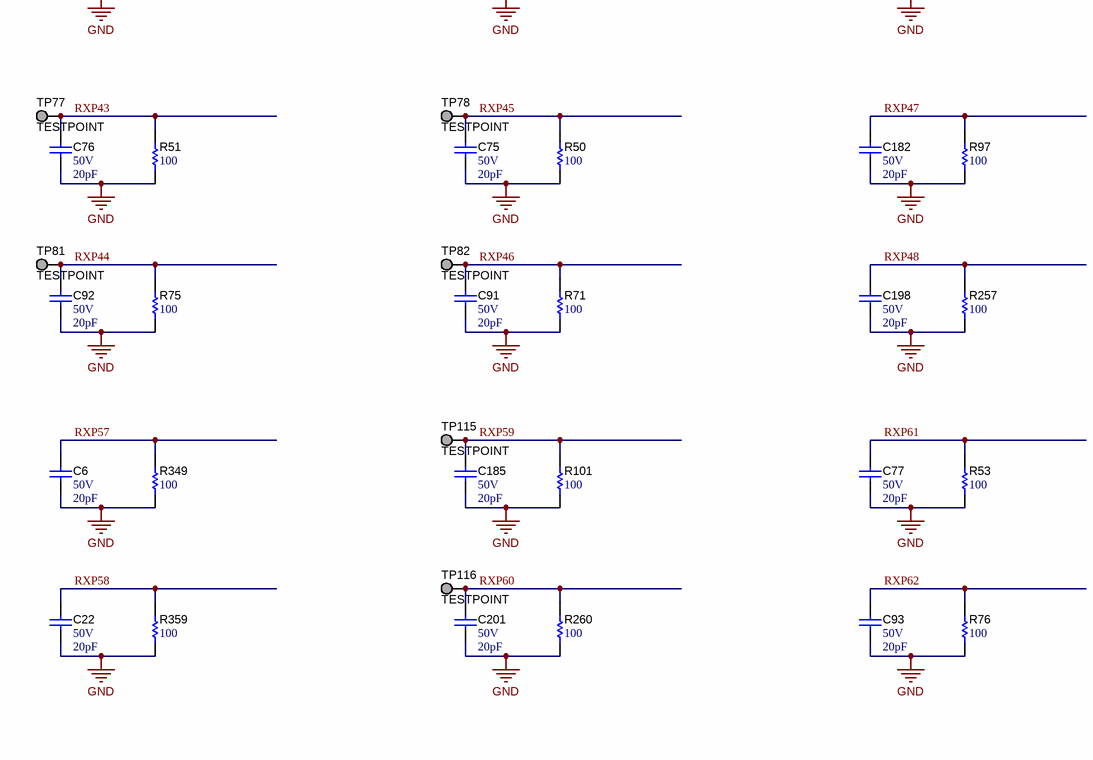
[diagram p6: DC309A_RXIN.SchDoc, bottom left]
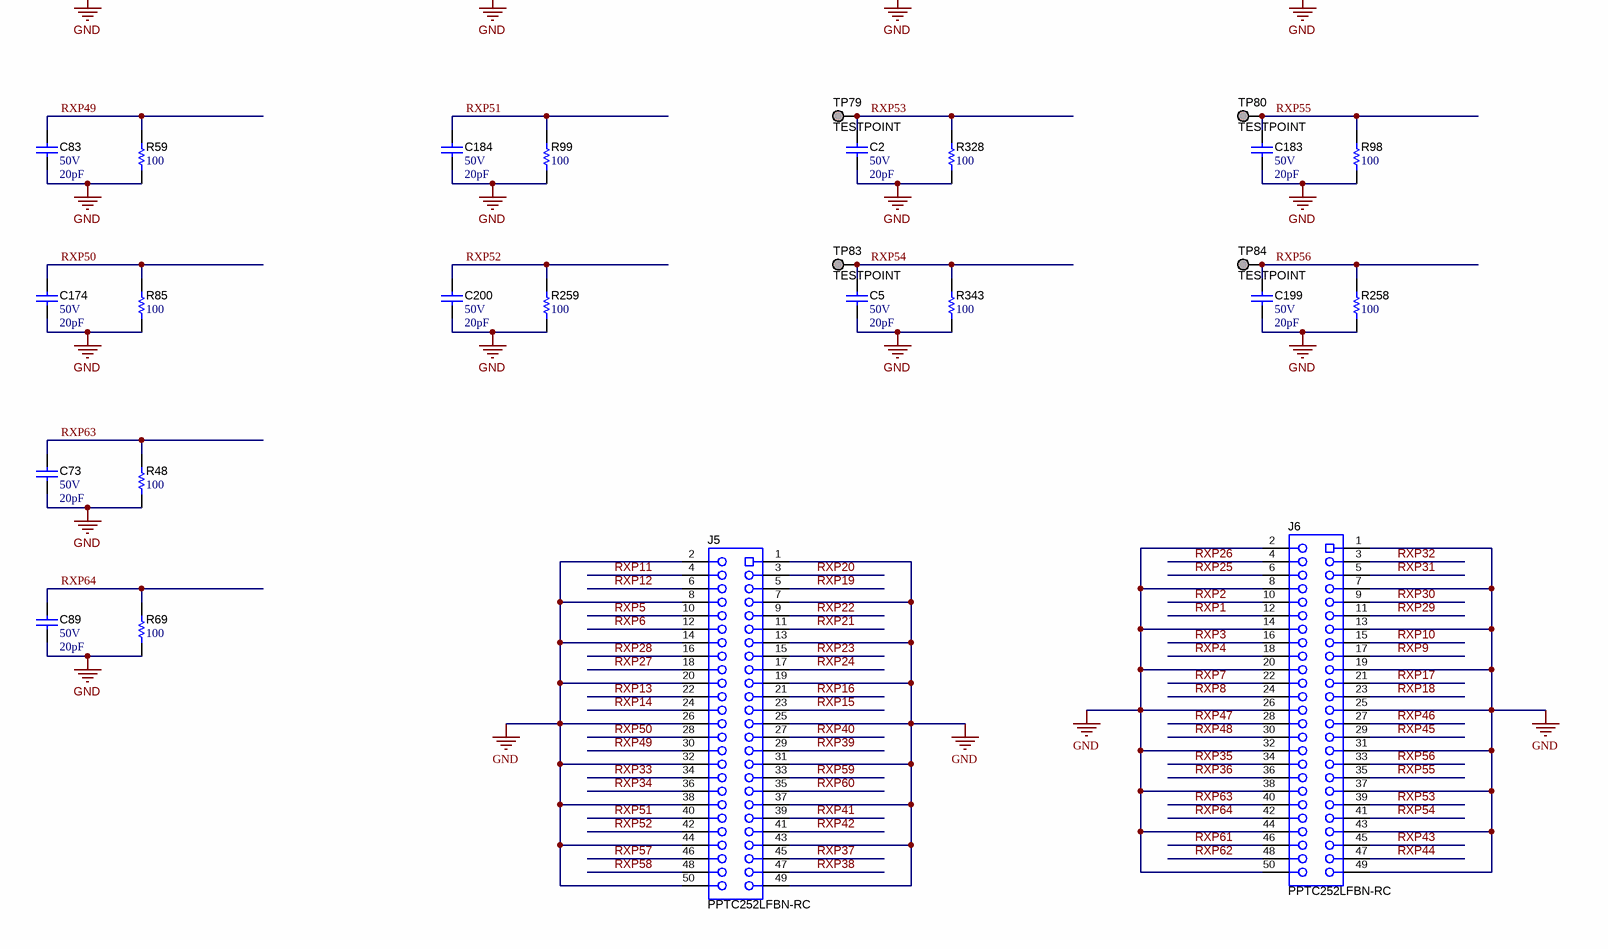
[diagram p7: DC309A_RXIN.SchDoc, bottom right]

### Parts
C2  VDC_V: 50V  ValueDisplayed: 20pF  [0402]  (hidden comment: C0402C200J5GACTU)
C5  VDC_V: 50V  ValueDisplayed: 20pF  [0402]  (hidden comment: C0402C200J5GACTU)
C6  VDC_V: 50V  ValueDisplayed: 20pF  [0402]  (hidden comment: C0402C200J5GACTU)
C22  VDC_V: 50V  ValueDisplayed: 20pF  [0402]  (hidden comment: C0402C200J5GACTU)
C71  VDC_V: 50V  ValueDisplayed: 20pF  [0402]  (hidden comment: C0402C200J5GACTU)
C72  VDC_V: 50V  ValueDisplayed: 20pF  [0402]  (hidden comment: C0402C200J5GACTU)
C73  VDC_V: 50V  ValueDisplayed: 20pF  [0402]  (hidden comment: C0402C200J5GACTU)
C74  VDC_V: 50V  ValueDisplayed: 20pF  [0402]  (hidden comment: C0402C200J5GACTU)
C75  VDC_V: 50V  ValueDisplayed: 20pF  [0402]  (hidden comment: C0402C200J5GACTU)
C76  VDC_V: 50V  ValueDisplayed: 20pF  [0402]  (hidden comment: C0402C200J5GACTU)
C77  VDC_V: 50V  ValueDisplayed: 20pF  [0402]  (hidden comment: C0402C200J5GACTU)
C78  VDC_V: 50V  ValueDisplayed: 20pF  [0402]  (hidden comment: C0402C200J5GACTU)
C79  VDC_V: 50V  ValueDisplayed: 20pF  [0402]  (hidden comment: C0402C200J5GACTU)
C80  VDC_V: 50V  ValueDisplayed: 20pF  [0402]  (hidden comment: C0402C200J5GACTU)
C81  VDC_V: 50V  ValueDisplayed: 20pF  [0402]  (hidden comment: C0402C200J5GACTU)
C82  VDC_V: 50V  ValueDisplayed: 20pF  [0402]  (hidden comment: C0402C200J5GACTU)
C83  VDC_V: 50V  ValueDisplayed: 20pF  [0402]  (hidden comment: C0402C200J5GACTU)
C84  VDC_V: 50V  ValueDisplayed: 20pF  [0402]  (hidden comment: C0402C200J5GACTU)
C86  VDC_V: 50V  ValueDisplayed: 20pF  [0402]  (hidden comment: C0402C200J5GACTU)
C87  VDC_V: 50V  ValueDisplayed: 20pF  [0402]  (hidden comment: C0402C200J5GACTU)
C88  VDC_V: 50V  ValueDisplayed: 20pF  [0402]  (hidden comment: C0402C200J5GACTU)
C89  VDC_V: 50V  ValueDisplayed: 20pF  [0402]  (hidden comment: C0402C200J5GACTU)
C90  VDC_V: 50V  ValueDisplayed: 20pF  [0402]  (hidden comment: C0402C200J5GACTU)
C91  VDC_V: 50V  ValueDisplayed: 20pF  [0402]  (hidden comment: C0402C200J5GACTU)
C92  VDC_V: 50V  ValueDisplayed: 20pF  [0402]  (hidden comment: C0402C200J5GACTU)
C93  VDC_V: 50V  ValueDisplayed: 20pF  [0402]  (hidden comment: C0402C200J5GACTU)
C94  VDC_V: 50V  ValueDisplayed: 20pF  [0402]  (hidden comment: C0402C200J5GACTU)
C95  VDC_V: 50V  ValueDisplayed: 20pF  [0402]  (hidden comment: C0402C200J5GACTU)
C96  VDC_V: 50V  ValueDisplayed: 20pF  [0402]  (hidden comment: C0402C200J5GACTU)
C97  VDC_V: 50V  ValueDisplayed: 20pF  [0402]  (hidden comment: C0402C200J5GACTU)
C98  VDC_V: 50V  ValueDisplayed: 20pF  [0402]  (hidden comment: C0402C200J5GACTU)
C174  VDC_V: 50V  ValueDisplayed: 20pF  [0402]  (hidden comment: C0402C200J5GACTU)
C175  VDC_V: 50V  ValueDisplayed: 20pF  [0402]  (hidden comment: C0402C200J5GACTU)
C177  VDC_V: 50V  ValueDisplayed: 20pF  [0402]  (hidden comment: C0402C200J5GACTU)
C178  VDC_V: 50V  ValueDisplayed: 20pF  [0402]  (hidden comment: C0402C200J5GACTU)
C179  VDC_V: 50V  ValueDisplayed: 20pF  [0402]  (hidden comment: C0402C200J5GACTU)
C180  VDC_V: 50V  ValueDisplayed: 20pF  [0402]  (hidden comment: C0402C200J5GACTU)
C181  VDC_V: 50V  ValueDisplayed: 20pF  [0402]  (hidden comment: C0402C200J5GACTU)
C182  VDC_V: 50V  ValueDisplayed: 20pF  [0402]  (hidden comment: C0402C200J5GACTU)
C183  VDC_V: 50V  ValueDisplayed: 20pF  [0402]  (hidden comment: C0402C200J5GACTU)
C184  VDC_V: 50V  ValueDisplayed: 20pF  [0402]  (hidden comment: C0402C200J5GACTU)
C185  VDC_V: 50V  ValueDisplayed: 20pF  [0402]  (hidden comment: C0402C200J5GACTU)
C186  VDC_V: 50V  ValueDisplayed: 20pF  [0402]  (hidden comment: C0402C200J5GACTU)
C187  VDC_V: 50V  ValueDisplayed: 20pF  [0402]  (hidden comment: C0402C200J5GACTU)
C188  VDC_V: 50V  ValueDisplayed: 20pF  [0402]  (hidden comment: C0402C200J5GACTU)
C189  VDC_V: 50V  ValueDisplayed: 20pF  [0402]  (hidden comment: C0402C200J5GACTU)
C190  VDC_V: 50V  ValueDisplayed: 20pF  [0402]  (hidden comment: C0402C200J5GACTU)
C191  VDC_V: 50V  ValueDisplayed: 20pF  [0402]  (hidden comment: C0402C200J5GACTU)
C193  VDC_V: 50V  ValueDisplayed: 20pF  [0402]  (hidden comment: C0402C200J5GACTU)
C194  VDC_V: 50V  ValueDisplayed: 20pF  [0402]  (hidden comment: C0402C200J5GACTU)
C195  VDC_V: 50V  ValueDisplayed: 20pF  [0402]  (hidden comment: C0402C200J5GACTU)
C196  VDC_V: 50V  ValueDisplayed: 20pF  [0402]  (hidden comment: C0402C200J5GACTU)
C197  VDC_V: 50V  ValueDisplayed: 20pF  [0402]  (hidden comment: C0402C200J5GACTU)
C198  VDC_V: 50V  ValueDisplayed: 20pF  [0402]  (hidden comment: C0402C200J5GACTU)
C199  VDC_V: 50V  ValueDisplayed: 20pF  [0402]  (hidden comment: C0402C200J5GACTU)
C200  VDC_V: 50V  ValueDisplayed: 20pF  [0402]  (hidden comment: C0402C200J5GACTU)
C201  VDC_V: 50V  ValueDisplayed: 20pF  [0402]  (hidden comment: C0402C200J5GACTU)
C202  VDC_V: 50V  ValueDisplayed: 20pF  [0402]  (hidden comment: C0402C200J5GACTU)
C203  VDC_V: 50V  ValueDisplayed: 20pF  [0402]  (hidden comment: C0402C200J5GACTU)
C204  VDC_V: 50V  ValueDisplayed: 20pF  [0402]  (hidden comment: C0402C200J5GACTU)
C205  VDC_V: 50V  ValueDisplayed: 20pF  [0402]  (hidden comment: C0402C200J5GACTU)
C207  VDC_V: 50V  ValueDisplayed: 20pF  [0402]  (hidden comment: C0402C200J5GACTU)
C213  VDC_V: 50V  ValueDisplayed: 20pF  [0402]  (hidden comment: C0402C200J5GACTU)
C215  VDC_V: 50V  ValueDisplayed: 20pF  [0402]  (hidden comment: C0402C200J5GACTU)
J5  PPTC252LFBN-RC  [Sullins_xPxC252LFBN]
J6  PPTC252LFBN-RC  [Sullins_xPxC252LFBN]
R46  ValueDisplayed: 100  [0402]  (hidden comment: RG1005P-101-B-T5)
R47  ValueDisplayed: 100  [0402]  (hidden comment: RG1005P-101-B-T5)
R48  ValueDisplayed: 100  [0402]  (hidden comment: RG1005P-101-B-T5)
R49  ValueDisplayed: 100  [0402]  (hidden comment: RG1005P-101-B-T5)
R50  ValueDisplayed: 100  [0402]  (hidden comment: RG1005P-101-B-T5)
R51  ValueDisplayed: 100  [0402]  (hidden comment: RG1005P-101-B-T5)
R53  ValueDisplayed: 100  [0402]  (hidden comment: RG1005P-101-B-T5)
R54  ValueDisplayed: 100  [0402]  (hidden comment: RG1005P-101-B-T5)
R55  ValueDisplayed: 100  [0402]  (hidden comment: RG1005P-101-B-T5)
R56  ValueDisplayed: 100  [0402]  (hidden comment: RG1005P-101-B-T5)
R57  ValueDisplayed: 100  [0402]  (hidden comment: RG1005P-101-B-T5)
R58  ValueDisplayed: 100  [0402]  (hidden comment: RG1005P-101-B-T5)
R59  ValueDisplayed: 100  [0402]  (hidden comment: RG1005P-101-B-T5)
R60  ValueDisplayed: 100  [0402]  (hidden comment: RG1005P-101-B-T5)
R63  ValueDisplayed: 100  [0402]  (hidden comment: RG1005P-101-B-T5)
R64  ValueDisplayed: 100  [0402]  (hidden comment: RG1005P-101-B-T5)
R68  ValueDisplayed: 100  [0402]  (hidden comment: RG1005P-101-B-T5)
R69  ValueDisplayed: 100  [0402]  (hidden comment: RG1005P-101-B-T5)
R70  ValueDisplayed: 100  [0402]  (hidden comment: RG1005P-101-B-T5)
R71  ValueDisplayed: 100  [0402]  (hidden comment: RG1005P-101-B-T5)
R75  ValueDisplayed: 100  [0402]  (hidden comment: RG1005P-101-B-T5)
R76  ValueDisplayed: 100  [0402]  (hidden comment: RG1005P-101-B-T5)
R80  ValueDisplayed: 100  [0402]  (hidden comment: RG1005P-101-B-T5)
R81  ValueDisplayed: 100  [0402]  (hidden comment: RG1005P-101-B-T5)
R82  ValueDisplayed: 100  [0402]  (hidden comment: RG1005P-101-B-T5)
R83  ValueDisplayed: 100  [0402]  (hidden comment: RG1005P-101-B-T5)
R84  ValueDisplayed: 100  [0402]  (hidden comment: RG1005P-101-B-T5)
R85  ValueDisplayed: 100  [0402]  (hidden comment: RG1005P-101-B-T5)
R87  ValueDisplayed: 100  [0402]  (hidden comment: RG1005P-101-B-T5)
R90  ValueDisplayed: 100  [0402]  (hidden comment: RG1005P-101-B-T5)
R93  ValueDisplayed: 100  [0402]  (hidden comment: RG1005P-101-B-T5)
R94  ValueDisplayed: 100  [0402]  (hidden comment: RG1005P-101-B-T5)
R95  ValueDisplayed: 100  [0402]  (hidden comment: RG1005P-101-B-T5)
R96  ValueDisplayed: 100  [0402]  (hidden comment: RG1005P-101-B-T5)
R97  ValueDisplayed: 100  [0402]  (hidden comment: RG1005P-101-B-T5)
R98  ValueDisplayed: 100  [0402]  (hidden comment: RG1005P-101-B-T5)
R99  ValueDisplayed: 100  [0402]  (hidden comment: RG1005P-101-B-T5)
R101  ValueDisplayed: 100  [0402]  (hidden comment: RG1005P-101-B-T5)
R102  ValueDisplayed: 100  [0402]  (hidden comment: RG1005P-101-B-T5)
R106  ValueDisplayed: 100  [0402]  (hidden comment: RG1005P-101-B-T5)
R107  ValueDisplayed: 100  [0402]  (hidden comment: RG1005P-101-B-T5)
R117  ValueDisplayed: 100  [0402]  (hidden comment: RG1005P-101-B-T5)
R121  ValueDisplayed: 100  [0402]  (hidden comment: RG1005P-101-B-T5)
R159  ValueDisplayed: 100  [0402]  (hidden comment: RG1005P-101-B-T5)
R237  ValueDisplayed: 100  [0402]  (hidden comment: RG1005P-101-B-T5)
R238  ValueDisplayed: 100  [0402]  (hidden comment: RG1005P-101-B-T5)
R239  ValueDisplayed: 100  [0402]  (hidden comment: RG1005P-101-B-T5)
R255  ValueDisplayed: 100  [0402]  (hidden comment: RG1005P-101-B-T5)
R256  ValueDisplayed: 100  [0402]  (hidden comment: RG1005P-101-B-T5)
R257  ValueDisplayed: 100  [0402]  (hidden comment: RG1005P-101-B-T5)
R258  ValueDisplayed: 100  [0402]  (hidden comment: RG1005P-101-B-T5)
R259  ValueDisplayed: 100  [0402]  (hidden comment: RG1005P-101-B-T5)
R260  ValueDisplayed: 100  [0402]  (hidden comment: RG1005P-101-B-T5)
R261  ValueDisplayed: 100  [0402]  (hidden comment: RG1005P-101-B-T5)
R281  ValueDisplayed: 100  [0402]  (hidden comment: RG1005P-101-B-T5)
R282  ValueDisplayed: 100  [0402]  (hidden comment: RG1005P-101-B-T5)
R287  ValueDisplayed: 100  [0402]  (hidden comment: RG1005P-101-B-T5)
R288  ValueDisplayed: 100  [0402]  (hidden comment: RG1005P-101-B-T5)
R289  ValueDisplayed: 100  [0402]  (hidden comment: RG1005P-101-B-T5)
R291  ValueDisplayed: 100  [0402]  (hidden comment: RG1005P-101-B-T5)
R328  ValueDisplayed: 100  [0402]  (hidden comment: RG1005P-101-B-T5)
R343  ValueDisplayed: 100  [0402]  (hidden comment: RG1005P-101-B-T5)
R349  ValueDisplayed: 100  [0402]  (hidden comment: RG1005P-101-B-T5)
R359  ValueDisplayed: 100  [0402]  (hidden comment: RG1005P-101-B-T5)
TP69  TESTPOINT  [TP_50MIL-SMT]  (no BOM)
TP70  TESTPOINT  [TP_50MIL-SMT]  (no BOM)
TP71  TESTPOINT  [TP_50MIL-SMT]  (no BOM)
TP72  TESTPOINT  [TP_50MIL-SMT]  (no BOM)
TP73  TESTPOINT  [TP_50MIL-SMT]  (no BOM)
TP74  TESTPOINT  [TP_50MIL-SMT]  (no BOM)
TP75  TESTPOINT  [TP_50MIL-SMT]  (no BOM)
TP76  TESTPOINT  [TP_50MIL-SMT]  (no BOM)
TP77  TESTPOINT  [TP_50MIL-SMT]  (no BOM)
TP78  TESTPOINT  [TP_50MIL-SMT]  (no BOM)
TP79  TESTPOINT  [TP_50MIL-SMT]  (no BOM)
TP80  TESTPOINT  [TP_50MIL-SMT]  (no BOM)
TP81  TESTPOINT  [TP_50MIL-SMT]  (no BOM)
TP82  TESTPOINT  [TP_50MIL-SMT]  (no BOM)
TP83  TESTPOINT  [TP_50MIL-SMT]  (no BOM)
TP84  TESTPOINT  [TP_50MIL-SMT]  (no BOM)
TP101  TESTPOINT  [TP_50MIL-SMT]  (no BOM)
TP102  TESTPOINT  [TP_50MIL-SMT]  (no BOM)
TP103  TESTPOINT  [TP_50MIL-SMT]  (no BOM)
TP104  TESTPOINT  [TP_50MIL-SMT]  (no BOM)
TP105  TESTPOINT  [TP_50MIL-SMT]  (no BOM)
TP106  TESTPOINT  [TP_50MIL-SMT]  (no BOM)
TP107  TESTPOINT  [TP_50MIL-SMT]  (no BOM)
TP108  TESTPOINT  [TP_50MIL-SMT]  (no BOM)
TP109  TESTPOINT  [TP_50MIL-SMT]  (no BOM)
TP110  TESTPOINT  [TP_50MIL-SMT]  (no BOM)
TP111  TESTPOINT  [TP_50MIL-SMT]  (no BOM)
TP112  TESTPOINT  [TP_50MIL-SMT]  (no BOM)
TP113  TESTPOINT  [TP_50MIL-SMT]  (no BOM)
TP114  TESTPOINT  [TP_50MIL-SMT]  (no BOM)
TP115  TESTPOINT  [TP_50MIL-SMT]  (no BOM)
TP116  TESTPOINT  [TP_50MIL-SMT]  (no BOM)

### Nets
GND: C2.2 C5.2 C6.2 C22.2 C71.2 C72.2 C73.2 C74.2 C75.2 C76.2 C77.2 C78.2 C79.2 C80.2 C81.2 C82.2 C83.2 C84.2 C86.2 C87.2 C88.2 C89.2 C90.2 C91.2 C92.2 C93.2 C94.2 C95.2 C96.2 C97.2 C98.2 C174.2 C175.2 C177.2 C178.2 C179.2 C180.2 C181.2 C182.2 C183.2 C184.2 C185.2 C186.2 C187.2 C188.2 C189.2 C190.2 C191.2 C193.2 C194.2 C195.2 C196.2 C197.2 C198.2 C199.2 C200.2 C201.2 C202.2 C203.2 C204.2 C205.2 C207.2 C213.2 C215.2 J5.1 J5.2 J5.7 J5.8 J5.13 J5.14 J5.19 J5.20 J5.25 J5.26 J5.31 J5.32 J5.37 J5.38 J5.43 J5.44 J5.49 J5.50 J6.1 J6.2 J6.7 J6.8 J6.13 J6.14 J6.19 J6.20 J6.25 J6.26 J6.31 J6.32 J6.37 J6.38 J6.43 J6.44 J6.49 J6.50 R46.1 R47.1 R48.1 R49.1 R50.1 R51.1 R53.1 R54.1 R55.1 R56.1 R57.1 R58.1 R59.1 R60.1 R63.1 R64.1 R68.1 R69.1 R70.1 R71.1 R75.1 R76.1 R80.1 R81.1 R82.1 R83.1 R84.1 R85.1 R87.1 R90.1 R93.1 R94.1 R95.1 R96.1 R97.1 R98.1 R99.1 R101.1 R102.1 R106.1 R107.1 R117.1 R121.1 R159.1 R237.1 R238.1 R239.1 R255.1 R256.1 R257.1 R258.1 R259.1 R260.1 R261.1 R281.1 R282.1 R287.1 R288.1 R289.1 R291.1 R328.1 R343.1 R349.1 R359.1
RXP1: C179.1 J6.12 R94.2
RXP2: C195.1 J6.10 R239.2
RXP3: C188.1 J6.16 R107.2
RXP4: C204.1 J6.18 R282.2
RXP5: C79.1 J5.10 R55.2
RXP6: C95.1 J5.12 R81.2
RXP7: C189.1 J6.22 R117.2
RXP8: C205.1 J6.24 R287.2
RXP9: C186.1 J6.17 R102.2 TP69.1
RXP10: C202.1 J6.15 R261.2 TP70.1
RXP11: C71.1 J5.4 R46.2
RXP12: C87.1 J5.6 R64.2
RXP13: C181.1 J5.22 R96.2
RXP14: C197.1 J5.24 R256.2
RXP15: C74.1 J5.23 R49.2 TP101.1
RXP16: C90.1 J5.21 R70.2 TP105.1
RXP17: C78.1 J6.21 R54.2 TP71.1
RXP18: C94.1 J6.23 R80.2 TP72.1
RXP19: C72.1 J5.5 R47.2 TP102.1
RXP20: C88.1 J5.3 R68.2 TP106.1
RXP21: C187.1 J5.11 R106.2 TP103.1
RXP22: C203.1 J5.9 R281.2 TP107.1
RXP23: C180.1 J5.15 R95.2 TP104.1
RXP24: C196.1 J5.17 R255.2 TP108.1
RXP25: C80.1 J6.6 R56.2
RXP26: C96.1 J6.4 R82.2
RXP27: C178.1 J5.18 R93.2
RXP28: C194.1 J5.16 R238.2
RXP29: C81.1 J6.11 R57.2 TP73.1
RXP30: C97.1 J6.9 R83.2 TP75.1
RXP31: C84.1 J6.5 R60.2 TP74.1
RXP32: C175.1 J6.3 R87.2 TP76.1
RXP33: C191.1 J5.34 R159.2
RXP34: C213.1 J5.36 R289.2
RXP35: C86.1 J6.34 R63.2
RXP36: C177.1 J6.36 R90.2
RXP37: C82.1 J5.45 R58.2 TP109.1
RXP38: C98.1 J5.47 R84.2 TP112.1
RXP39: C190.1 J5.29 R121.2 TP110.1
RXP40: C207.1 J5.27 R288.2 TP113.1
RXP41: C193.1 J5.39 R237.2 TP111.1
RXP42: C215.1 J5.41 R291.2 TP114.1
RXP43: C76.1 J6.45 R51.2 TP77.1
RXP44: C92.1 J6.47 R75.2 TP81.1
RXP45: C75.1 J6.29 R50.2 TP78.1
RXP46: C91.1 J6.27 R71.2 TP82.1
RXP47: C182.1 J6.28 R97.2
RXP48: C198.1 J6.30 R257.2
RXP49: C83.1 J5.30 R59.2
RXP50: C174.1 J5.28 R85.2
RXP51: C184.1 J5.40 R99.2
RXP52: C200.1 J5.42 R259.2
RXP53: C2.1 J6.39 R328.2 TP79.1
RXP54: C5.1 J6.41 R343.2 TP83.1
RXP55: C183.1 J6.35 R98.2 TP80.1
RXP56: C199.1 J6.33 R258.2 TP84.1
RXP57: C6.1 J5.46 R349.2
RXP58: C22.1 J5.48 R359.2
RXP59: C185.1 J5.33 R101.2 TP115.1
RXP60: C201.1 J5.35 R260.2 TP116.1
RXP61: C77.1 J6.46 R53.2
RXP62: C93.1 J6.48 R76.2
RXP63: C73.1 J6.40 R48.2
RXP64: C89.1 J6.42 R69.2

### Notes on the sheet
- RX PINS AND LOADS
- Labels drawn without touching a wire or pin: \
- Drawn By:
- SVN Rev:
- Number:
- TID #:
- Orderable:
- Rev:
- Sheet Title:
- File:
- Project Title:
- Designed for:
- Assembly Variant:
- Mod. Date:
- Sheet:
- Size:
- of
- C
- http://www.ti.com
- Texas Instruments and/or its licensors do not warrant the accuracy or completeness of this specification or any information contained therein. Texas Instruments and/or its licensors do not warrant that this design will meet the specifications, will be suitable for your application or fit for any particular purpose, or will operate in an implementation. Texas Instruments and/or its licensors do not warrant that the design is production worthy. You should completely validate and test your design implementation to confirm the system functionality for your application.
- Engineer:
- Contact:
- © Texas Instruments

### Library data of the parts
C2 C5 C6 C22 C71-C84 C86-C98 C174 C175 C177-C191 C193-C205 C207 C213 C215 = CMP-0006241-2: CAP, CERM, 20 pF, 50 V, +/- 5%, C0G/NP0, 0402; Manufacturer: Kemet; TaMin_C: -55°C; Polarized: N; SizeAreaWB_mm2: 3; Value1: Unknown; U/M: EA; Value: 20pF; TaMax_C: 125°C; SizeZ_mm: 0.6; SizeX_mm: 1; SizeY_mm: 0.5; AEC Category: Q200; Supplier Part Number 2: 29T8938; Publisher: Texas Instruments; Supplier 2: Newark; Supplier Part Number 3: 80-C0402C200J5G; TempCo: C0G/NP0; Supplier 3: Mouser; Published: 2008-06-19; RoHS: Y; MountType: SMT; Supplier 1: Digi-Key; PackageReference: 0402; Tolerance_%: 5%; Cap_Case: 0402; Value2: 50V; SizeArea_mm2: 0.5; CompType: Capacitor; LatestRevisionDate: 2017-03-09; PartNumber: C0402C200J5GACTU; AEC Qualified: N; Cap_F: 20pF; ComponentLink1Description: Datasheet link; AEC Grade: N/A; Supplier Part Number 1: 399-7773-1-ND; Technology: Ceramic; ComponentLink1URL: http://www.kemet.com/docfinder?Partnumber=C0402C200J5GACTU
J5 J6 = CMP-0054672-1: Receptacle, 2.54mm, 25x2, Tin, TH; Manufacturer: Sullins Connector Solutions; CNHeader: FALSE; Current_A: 3A; Gender: Female; Voltage_V: 250V; CompType: Socket Strip; Row_Count: 2; RowSpacing_mm: 2.54; CT: TRUE; Cert_UL: Y; ComponentLink1URL: http://www.sullinscorp.com/drawings/78_P(N)PxCxxxLFBN-RC,_10492-H.pdf; Publisher: Texas Instruments; Color: Black; RoHS: Y; MountType: TH; Supplier 1: Digi-Key; PackageReference: Receptacle, 2.54mm, 25x2, TH; PinCount: 50; LatestRevisionDate: 26/05/2017; PartNumber: PPTC252LFBN-RC; Orientation: Vertical; ComponentLink1Description: Datasheet URL; Supplier Part Number 1: S7093-ND; Pitch_mm: 2.54; ContactFinish: Tin
R46-R51 R53-R60 R63 R64 R68-R71 R75 R76 R80-R85 R87 R90 R93-R99 R101 R102 R106 R107 R117 R121 R159 R237-R239 R255-R261 R281 R282 R287-R289 R291 R328 R343 R349 R359 = CMP-0026814-1: RES, 100, 0.1%, 0.063 W, 0402; Manufacturer: Susumu Co Ltd; Power_W: 63mW; TempCo: 25 ppm/C; Value_Code: 100R; U/M: EA; Value: 100; SizeX_mm: 1; SizeY_mm: 0.5; SizeZ_mm: 0.6; Value2: 0.063W; AEC Category: Q200; EIA_Code: E192; ComponentLink1URL: http://www.susumu-usa.com/pdf/RG_Data_Sheet.pdf; Supplier Part Number 2: 85K1457; Publisher: Texas Instruments; Supplier 2: Newark; Supplier Part Number 3: 754-RG1005P-101-B-T5; Supplier 3: Mouser; Published: 2008-06-26; RoHS: Y; Value1: 0.1%; MountType: SMT; Supplier 1: Digi-Key; PackageReference: 0402; Tolerance_%: 0.1%; Res_ohm: 100; SizeArea_mm2: 0.5; CompType: Resistor; LatestRevisionDate: 2017-03-09; PartNumber: RG1005P-101-B-T5; AEC Qualified: ?; ComponentLink1Description: Datasheet link; Supplier Part Number 1: RG10P100BCT-ND; Technology: Thin Film
TP69-TP84 TP101-TP116 = CMP-0078143-3: TEST POINT.  No entry in BOM.; PackageReference: N/A; CompType: Testpoint; Manufacturer: N/A; PartNumber: N/A; Library Reference: TESTPOINT